# Altium project jarvas_anchor.PrjPcb
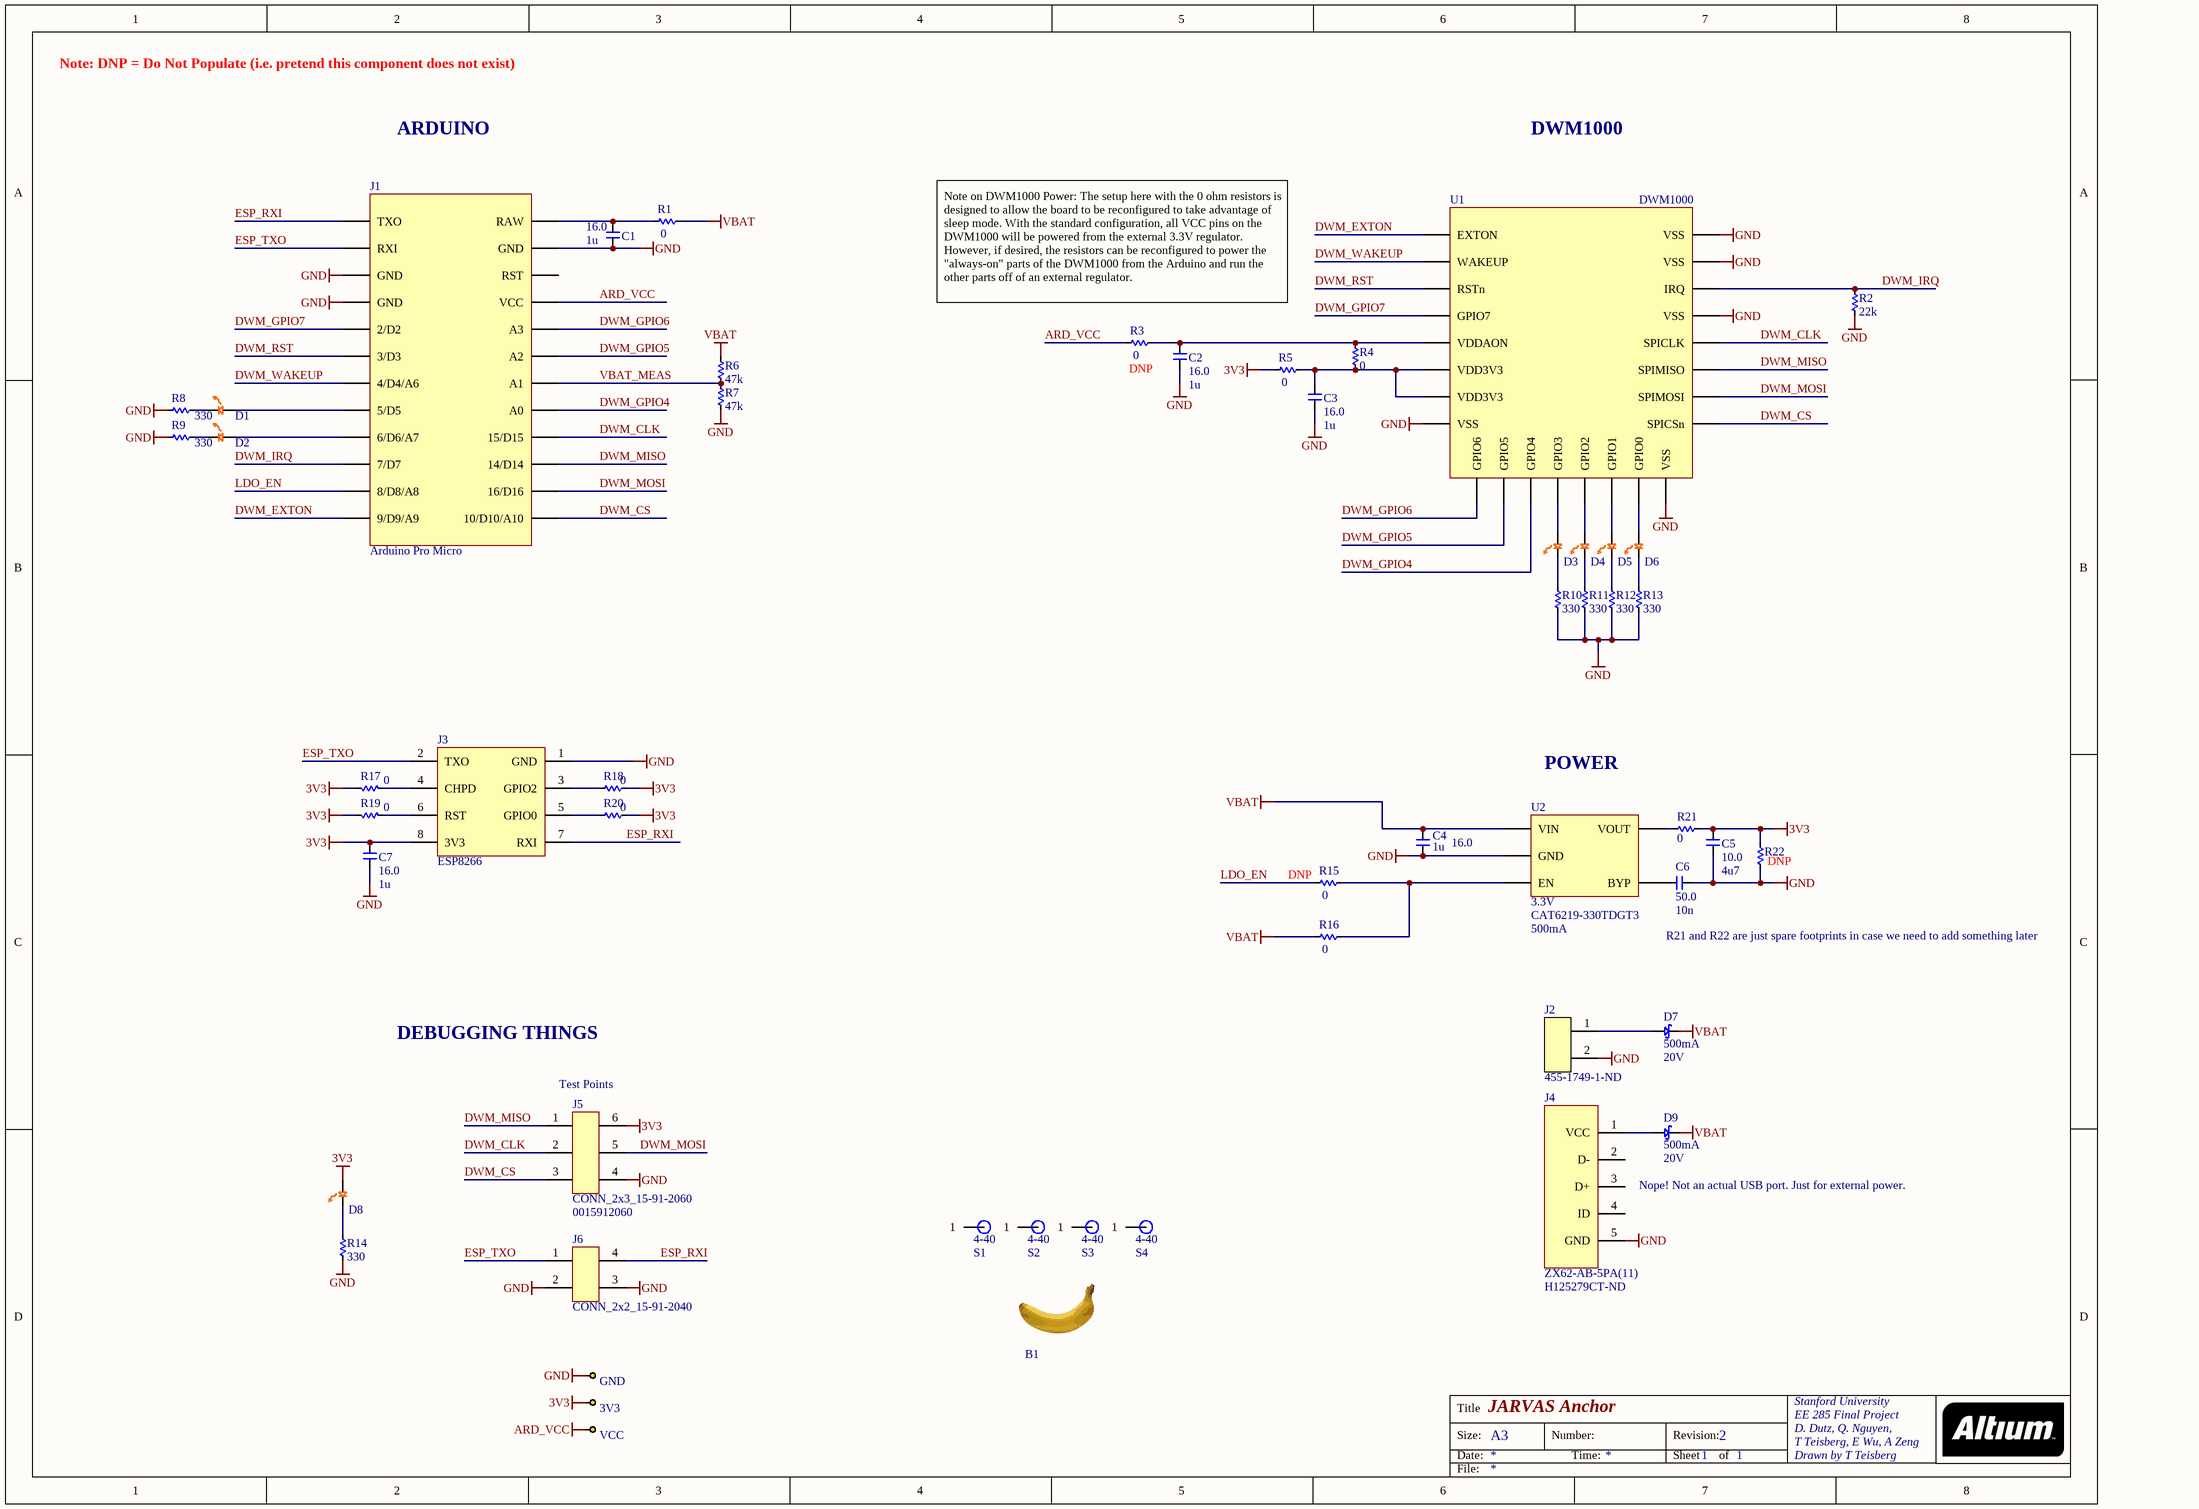
[diagram p0: dwm1000arduino.SchDoc]
1 sheet, 54 parts. Net scope: global (net labels, ports and power ports of the same name join across sheets).
Board file: dwm1000arduino.PcbDoc

## Sheet dwm1000arduino.SchDoc: JARVAS Anchor
size A3; CompanyName: Stanford University; Organization: Stanford University; Address1: EE 285 Final Project; Address2: D. Dutz, Q. Nguyen,; Address3: T Teisberg, E Wu, A Zeng; Address4: Drawn by T Teisberg; Revision: 2; SheetNumber: 1; SheetTotal: 1

### Parts
3V3  TEST_KEYSTONE5015  [TP_KEYSTONE_5015]  (value not drawn)
B1  Banananannaa!  [BANANA_OPEN]  (value not drawn)
C1  voltage: 16.0  human_value: 1u  [C0603]  (hidden comment: __template_cap)
C2  voltage: 16.0  human_value: 1u  [C0603]  (hidden comment: __template_cap)
C3  voltage: 16.0  human_value: 1u  [C0603]  (hidden comment: __template_cap)
C4  voltage: 16.0  human_value: 1u  [C0603]  (hidden comment: __template_cap)
C5  voltage: 10.0  human_value: 4u7  [C0603]  (hidden comment: __template_cap)
C6  voltage: 50.0  human_value: 10n  [C0603]  (hidden comment: __template_cap)
C7  voltage: 16.0  human_value: 1u  [C0603]  (hidden comment: __template_cap)
D1  LED  [LED0603]  (value not drawn)
D2  LED  [LED0603]  (value not drawn)
D3  LED  [LED0603]  (value not drawn)
D4  LED  [LED0603]  (value not drawn)
D5  LED  [LED0603]  (value not drawn)
D6  LED  [LED0603]  (value not drawn)
D7  Current - Average Rectified (Io): 500mA  Voltage - DC Reverse (Vr) (Max): 20V  [SOD123]  (hidden comment: SCHOTTKY_MBR0520L)
D8  LED  [LED0603]  (value not drawn)
D9  Current - Average Rectified (Io): 500mA  Voltage - DC Reverse (Vr) (Max): 20V  [SOD123]  (hidden comment: SCHOTTKY_MBR0520L)
GND  TEST_KEYSTONE5015  [TP_KEYSTONE_5015]  (value not drawn)
J1  Arduino Pro Micro  [ArduinoProMicro]
J2  Supplier Part Number 1: 455-1749-1-ND  [CONN_JST_PH_SM4_2PIN_RA]  (hidden comment: CONN JST 2POS SMD)
J3  ESP8266  [PCBComponent_1]
J4  Manufacturer Part Number: ZX62-AB-5PA(11)  Supplier Part Number 1: H125279CT-ND  [HIROSE_ZX62-AB-5PA]  (hidden comment: CONN_USB_MICROAB_SMD_R/A)
J5  CONN_2x3_15-91-2060  Manufacturer Part Number: 0015912060  [MOLEX_15-91-2060]
J6  CONN_2x2_15-91-2040  [MOLEX_15-91-2040]
R1  Resistance (Machine readable): 0  [R0603]  (hidden comment: __template_resistor)
R2  value 22k  [R0603]  (hidden comment: __template_resistor)
R3  Resistance (Machine readable): 0  [R0603]  (hidden comment: __template_resistor)
R4  Resistance (Machine readable): 0  [R0603]  (hidden comment: __template_resistor)
R5  Resistance (Machine readable): 0  [R0603]  (hidden comment: __template_resistor)
R6  value 47k  [R0603]  (hidden comment: __template_resistor)
R7  value 47k  [R0603]  (hidden comment: __template_resistor)
R8  value 330  [R0603]  (hidden comment: __template_resistor)
R9  value 330  [R0603]  (hidden comment: __template_resistor)
R10  value 330  [R0603]  (hidden comment: __template_resistor)
R11  value 330  [R0603]  (hidden comment: __template_resistor)
R12  value 330  [R0603]  (hidden comment: __template_resistor)
R13  value 330  [R0603]  (hidden comment: __template_resistor)
R14  value 330  [R0603]  (hidden comment: __template_resistor)
R15  Resistance (Machine readable): 0  [R0603]  (hidden comment: __template_resistor)
R16  Resistance (Machine readable): 0  [R0603]  (hidden comment: __template_resistor)
R17  Resistance (Machine readable): 0  [R0603]  (hidden comment: __template_resistor)
R18  Resistance (Machine readable): 0  [R0603]  (hidden comment: __template_resistor)
R19  Resistance (Machine readable): 0  [R0603]  (hidden comment: __template_resistor)
R20  Resistance (Machine readable): 0  [R0603]  (hidden comment: __template_resistor)
R21  value 0  [R0603]  (hidden comment: __template_resistor)
R22  __template_resistor  [R0603]  (value not drawn)
S1  4-40 Machine screw  [SCREW_4-40]  (value not drawn)
S2  4-40 Machine screw  [SCREW_4-40]  (value not drawn)
S3  4-40 Machine screw  [SCREW_4-40]  (value not drawn)
S4  4-40 Machine screw  [SCREW_4-40]  (value not drawn)
U1  DWM1000  [DW1000]
U2  Voltage - Output: 3.3V  Manufacturer Part Number: CAT6219-330TDGT3  Current - Output: 500mA  [TSOT-23-5]  (hidden comment: 3.3V LDO)
VCC  TEST_KEYSTONE5015  [TP_KEYSTONE_5015]  (value not drawn)

### Nets
3V3: 3V3.1 C5.2 C7.1 D8.A J3.8(3V3) J5.6 R5.1 R17.2 R18.2 R19.2 R20.2 R21.2 R22.2
ARD_VCC: J1.21(VCC) R3.1 VCC.1
GND: C1.2 C2.2 C3.2 C4.1 C5.1 C6.2 C7.2 GND.1 J1.3(GND) J1.4(GND) J1.23(GND) J2.2 J3.1(GND) J4.5(GND) J5.4 J6.2 J6.3 R2.1 R7.1 R8.2 R9.2 R10.1 R11.1 R12.1 R13.1 R14.1 R22.1 U1.8(VSS) U1.16(VSS) U1.21(VSS) U1.23(VSS) U1.24(VSS) U2.2(GND)
VBAT: C4.2 D7.2 D9.2 R1.2 R6.2 R16.1 U2.1(VIN)
DWM_CLK: J1.16(15/D15) J5.2 U1.20(SPICLK)
DWM_CS: J1.13(10/D10/A10) J5.3 U1.17(SPICSn)
DWM_EXTON: J1.12(9/D9/A9) U1.1(EXTON)
DWM_GPIO4: J1.17(A0) U1.11(GPIO4)
DWM_GPIO5: J1.19(A2) U1.10(GPIO5)
DWM_GPIO6: J1.20(A3) U1.9(GPIO6)
DWM_GPIO7: J1.5(2/D2) U1.4(GPIO7)
DWM_IRQ: J1.10(7/D7) R2.2 U1.22(IRQ)
DWM_MISO: J1.15(14/D14) J5.1 U1.19(SPIMISO)
DWM_MOSI: J1.14(16/D16) J5.5 U1.18(SPIMOSI)
DWM_RST: J1.6(3/D3) U1.3(RSTn)
DWM_WAKEUP: J1.7(4/D4/A6) U1.2(WAKEUP)
ESP_RXI: J1.1(TXO) J3.7(RXI) J6.4
ESP_TXO: J1.2(RXI) J3.2(TXO) J6.1
LDO_EN: J1.11(8/D8/A8) R15.1
VBAT_MEAS: J1.18(A1) R6.1 R7.2
NetC1_1: C1.1 J1.24(RAW) R1.1
NetC2_1: C2.1 R3.2 R4.2 U1.5(VDDAON)
NetC3_1: C3.1 R4.1 R5.2 U1.6(VDD3V3) U1.7(VDD3V3)
NetC6_1: C6.1 U2.4(BYP)
NetD1_A: D1.A J1.8(5/D5)
NetD1_K: D1.K R8.1
NetD2_A: D2.A J1.9(6/D6/A7)
NetD2_K: D2.K R9.1
NetD3_A: D3.A U1.12(GPIO3)
NetD3_K: D3.K R10.2
NetD4_A: D4.A U1.13(GPIO2)
NetD4_K: D4.K R11.2
NetD5_A: D5.A U1.14(GPIO1)
NetD5_K: D5.K R12.2
NetD6_A: D6.A U1.15(GPIO0)
NetD6_K: D6.K R13.2
NetD7_1: D7.1 J2.1
NetD8_K: D8.K R14.2
NetD9_1: D9.1 J4.1(VCC)
NetJ3_3: J3.3(GPIO2) R18.1
NetJ3_4: J3.4(CHPD) R17.1
NetJ3_5: J3.5(GPIO0) R20.1
NetJ3_6: J3.6(RST) R19.1
NetR15_2: R15.2 R16.2 U2.3(EN)
NetR21_1: R21.1 U2.5(VOUT)

Not connected (* = marked no-connect by the designer): J1 22(RST); J4 2(D-) 3(D+) 4(ID); S1 1; S2 1; S3 1; S4 1

### Notes on the sheet
- Note: DNP = Do Not Populate (i.e. pretend this component does not exist)
- ARDUINO
- DWM1000
- Note on DWM1000 Power: The setup here with the 0 ohm resistors is designed to allow the board to be reconfigured to take advantage of sleep mode. With the standard configuration, all VCC pins on the DWM1000 will be powered from the external 3.3V regulator. However, if desired, the resistors can be reconfigured to power the "always-on" parts of the DWM1000 from the Arduino and run the other parts off of an external regulator.
- POWER
- R21 and R22 are just spare footprints in case we need to add something later
- DEBUGGING THINGS
- (near J5) Test Points
- Nope! Not an actual USB port. Just for external power.
- Title
- Size:
- Date:
- A3
- Number:
- Time:
- Revision:
- Sheet
- of
- File:
- (in symbol SCREW_4-40) 4-40

### Library data of the parts
3V3 GND VCC = TEST_KEYSTONE5015: PC TEST POINT MINIATURE SMT; Manufacturer: Keystone Electronics; Manufacturer Part Number: 5015; Supplier 1: Digi-Key; RoHS: RoHS Compliant; Category: Test and Measurement; Stock 1: 1322985; Pricing 1: 1=0.44, 10=0.413, 50=0.301, 100=0.2891, 250=0.25964, 500=0.24784 (USD); Type: PC Test Point, Miniature; Terminal: 0.010" (0.25mm) Phosphor Bronze, Silver Plate; Mounting Type: Surface Mount; Material: Phosphor Bronze; Color: -; Packaging: Cut Tape (CT); ComponentLink1URL: http://mail.keyelco.com/ENG._DEPT/PDF%20CAT%20NO%20Drawings/5015.pdf; ComponentLink1Description: Datasheet; Supplier Part Number 1: 5015KCT-ND
B1 = BANANA: Banana for scale; Potassium Content: Lots!
C1-C4 C7 = 587-1251-1-ND: type: capacitor; value: 1e-06; tolerance: 10%; Supplier Part Number 1: 587-1251-1-ND; package: 0603; price: 0.125
C5 = 587-1441-1-ND: type: capacitor; value: 4.7e-06; tolerance: 10%; Supplier Part Number 1: 587-1441-1-ND; package: 0603; price: 0.285
C6 = 399-1092-1-ND: type: capacitor; value: 1e-08; tolerance: 5%; Supplier Part Number 1: 399-1092-1-ND; package: 0603; price: 0.075
D1-D6 D8 = LED_LTST-C190KFKT_ORANGE: Orange 605nm LED Indication - Discrete 2V 0603 (1608 Metric); Manufacturer: Lite-On Inc.; Lens Color: Colorless; Lens Transparency: Clear; Millicandela Rating: 90mcd; Lens Style/Size: Rectangle with Flat Top, 1.10mm x 0.80mm; Current - Test: 20mA; Viewing Angle: 130°; Wavelength - Peak: 611nm; Supplier 1: Digi-Key; Manufacturer Part Number: LTST-C190KFKT; RoHS: RoHS Compliant; Category: Optoelectronics; Stock 1: 237550; Pricing 1: 1=0.25, 10=0.183, 25=0.1348, 100=0.0963, 250=0.06544, 500=0.05776, 1000=0.04524 (USD); Packaging: Cut Tape (CT); Part Status: Active; Color: Orange; Voltage - Forward (Vf) (Typ): 2V; Mounting Type: Surface Mount; Wavelength - Dominant: 605nm; Features: -; Package / Case: 0603 (1608 Metric); Supplier Device Package: *; Size / Dimension: 1.60mm L x 0.80mm W; Height (Max): 0.80mm; ComponentLink1URL: http://optoelectronics.liteon.com/upload/download/DS-22-99-0186/S_110_LTST-C190KFKT.pdf; ComponentLink1Description: http://optoelectronics.liteon.com/upload/download/DS-22-99-0186/S_110_LTST-C190KFKT.pdf; Supplier Part Number 1: 160-1434-1-ND
D7 D9 = SCHOTTKY_MBR0520L: DIODE SCHOTTKY 0.5A 20V SOD-123; Manufacturer: Fairchild Semiconductor; Speed: Fast Recovery =< 500ns, > 200mA (Io); Current - Reverse Leakage @ Vr: 250µA @ 20V; Voltage - Forward (Vf) (Max) @ If: 385mV @ 500mA; Supplier 1: Digi-Key; Manufacturer Part Number: MBR0520L; RoHS: RoHS Compliant; Category: Discrete Semiconductor Products; Stock 1: 217232; Pricing 1: 1=0.63, 10=0.43, 100=0.2024, 250=0.1442, 500=0.11006, 750=0.08603, 1000=0.0759 (USD); Diode Type: Schottky; Reverse Recovery Time (trr): -; Capacitance @ Vr, F: -; Mounting Type: Surface Mount; Package / Case: SOD-123; Supplier Device Package: SOD-123; Packaging: Cut Tape (CT); ComponentLink1URL: http://www.fairchildsemi.com/ds/MB/MBR0520L.pdf; ComponentLink1Description: Datasheet; Supplier Part Number 1: MBR0520LCT-ND
J1 = ArduinoProMicro_3V3_8MHz: SFE Arduino Pro Micro 3.3 V / 8 MHz; Supplier: SparkFun Electronics; Supplier Part Number: DEV-12587; ComponentLink1URL: https://cdn.sparkfun.com/datasheets/Dev/Arduino/Boards/ProMicro8MHzv1.pdf; ComponentLink1Description: Graphical Datasheet
J2 = CONN_JST_2_PH: CONN HEADER PH SIDE 2POS 2MM SMD; Manufacturer: JST Sales America Inc.; Manufacturer Part Number: S2B-PH-SM4-TB(LF)(SN); Connector Type: Header, Shrouded; Number of Positions: 2; Number of Positions Loaded: All; Pitch: 0.079" (2.00mm); Supplier 1: Digi-Key; RoHS: RoHS Compliant; Category: Connectors, Interconnects; Stock 1: 148568; Pricing 1: 1=0.56, 10=0.521, 25=0.4688, 50=0.4168, 100=0.3994, 250=0.36472, 500=0.34734 (USD); Packaging: Cut Tape (CT); Contact Type: Male Pin; Number of Rows: 1; Row Spacing: -; Contact Mating Length: 0.130" (3.30mm); Mounting Type: Surface Mount, Right Angle; Termination: Solder; Fastening Type: Detent Lock; Features: Solder Retention; Contact Finish: Tin; Contact Finish Thickness: -; Color: Natural; ComponentLink1URL: http://www.jst-mfg.com/product/pdf/eng/ePH.pdf; ComponentLink1Description: http://www.jst-mfg.com/product/pdf/eng/ePH.pdf
J3 = ESP8266_Module: RF TXRX MODULE WIFI TRACE ANT; Manufacturer: SparkFun Electronics; Manufacturer Part Number: WRL-13678; Protocol: 802.11b/g/n; Frequency: 2.4GHz ~ 2.48GHz; Data Rate: 72.2Mbps; Power - Output: 19.5dBm; Sensitivity: -98dBm; Serial Interfaces: SPI, UART; Antenna Type: Integrated, Trace; Memory Size: 1MB Flash; Voltage - Supply: 3.3V; Current - Receiving: 62mA; Current - Transmitting: 215mA; Supplier 1: Digi-Key; RoHS: RoHS Compliant; Category: RF/IF and RFID; Stock 1: 913; Pricing 1: 1=6.95 (USD); Packaging: Bulk; Part Status: Active; RF Family/Standard: WiFi; Modulation: -; Mounting Type: Through Hole; Operating Temperature: -20°C ~ 100°C; Package / Case: Module; ComponentLink1URL: https://nurdspace.nl/images/e/e0/ESP8266_Specifications_English.pdf; ComponentLink1Description: https://nurdspace.nl/images/e/e0/ESP8266_Specifications_English.pdf; Supplier Part Number 1: 1568-1235-ND; Supplier 2: SparkFun Electronics; Supplier Part Number 2: WRL-13678
J4 = CONN_USB_MICROAB_SMD_R/A: CONN RCPT MICRO USB AB SMD R/A; Manufacturer: Hirose Electric Co Ltd; Connector Type: USB - micro AB; Number of Contacts: 5; Gender: Receptacle; Specifications: USB 2.0; RoHS: RoHS Compliant; Category: Connectors, Interconnects; Packaging: Cut Tape (CT); Mounting Type: Surface Mount, Right Angle, Horizontal; Features: -; Ingress Protection: -; ComponentLink1URL: http://www.hirose.co.jp/cataloge_hp/e24200011.pdf; ComponentLink1Description: Datasheet; Supplier 1: Digi-Key
J5 = CONN_2x3_15-91-2060: CONN HEADER 6POS .100" VERT TIN; Manufacturer: Molex Inc; Connector Type: Header, Unshrouded, Breakaway; Number of Positions: 6; Number of Positions Loaded: All; Pitch: 0.100" (2.54mm); Supplier 1: Digi-Key; RoHS: RoHS Compliant; Category: Connectors, Interconnects; Stock 1: 5665; Pricing 1: 1=0.43, 10=0.4, 50=0.32, 100=0.3066, 250=0.27992, 500=0.2666, 1000=0.21995, 2500=0.19995, 5000=0.19329 (USD); Contact Type: Male Pin; Number of Rows: 2; Row Spacing: 0.100" (2.54mm); Contact Mating Length: 0.240" (6.10mm); Mounting Type: Surface Mount; Termination: Solder; Fastening Type: -; Features: -; Contact Finish: Tin; Contact Finish Thickness: 150µin (3.81µm); Color: Black; Packaging: Bulk; ComponentLink1URL: http://www.molex.com/pdm_docs/sd/015912060_sd.pdf; ComponentLink1Description: http://www.molex.com/pdm_docs/sd/015912060_sd.pdf; Supplier Part Number 1: WM17449-ND
J6 = CONN_2x2_15-91-2040: CONN HEADER 4POS .100" VERT TIN
R1 R3-R5 R15-R20 = CRCW06030000Z0EA: RES SMD 0.0 OHM; Manufacturer: Vishay Dale; Value: 1; Unit Price (USD): 0.081; Tolerance: ±1%; Power (Watts): 0.1W, 1/10W; Supplier Part Number: 541-0.0GCT-ND; Manufacturer Part Number: CRCW06030000Z0EA; type: resistor; Packaging: Cut Tape (CT); Series: CRCW; Package: 0603 (1608 Metric)
  R3 R15: DNP: DNP
R2 = CRCW060322K0FKEA: RES SMD 22K OHM 1% 1/10W 0603; Manufacturer: Vishay Dale; Resistance (Machine readable): 22000; Unit Price (USD): 0.081; Power (Watts): 0.1W, 1/10W; Supplier Part Number: 541-22.0KHCT-ND; Manufacturer Part Number: CRCW060322K0FKEA; type: resistor; Packaging: Cut Tape (CT); Series: CRCW; Tolerance: ±1%; Package: 0603 (1608 Metric)
R6 R7 = CRCW060347K0FKEA: RES SMD 47K OHM 1% 1/10W 0603; Manufacturer: Vishay Dale; Resistance (Machine readable): 47000; Unit Price (USD): 0.081; Power (Watts): 0.1W, 1/10W; Supplier Part Number: 541-47.0KHCT-ND; Manufacturer Part Number: CRCW060347K0FKEA; type: resistor; Packaging: Cut Tape (CT); Series: CRCW; Tolerance: ±1%; Package: 0603 (1608 Metric)
R8-R14 = CRCW0603330RFKEA: RES SMD 330 OHM 1% 1/10W 0603; Manufacturer: Vishay Dale; Unit Price (USD): 0.081; Power (Watts): 0.1W, 1/10W; Supplier Part Number: 541-330HCT-ND; Manufacturer Part Number: CRCW0603330RFKEA; Resistance (Machine readable): 330; type: resistor; Packaging: Cut Tape (CT); Series: CRCW; Tolerance: ±1%; Package: 0603 (1608 Metric)
R21 = CRCW06030000Z0EA: RES SMD 0.0 OHM; Manufacturer: Vishay Dale; Unit Price (USD): 0.081; Tolerance: ±1%; Power (Watts): 0.1W, 1/10W; Supplier Part Number: 541-0.0GCT-ND; Manufacturer Part Number: CRCW06030000Z0EA; Resistance (Machine readable): 0; type: resistor; Packaging: Cut Tape (CT); Series: CRCW; Package: 0603 (1608 Metric)
R22 = CRCW06030000Z0EA: RES SMD 0.0 OHM; Manufacturer: Vishay Dale; Value: 0; Unit Price (USD): 0.081; Tolerance: ±1%; Power (Watts): 0.1W, 1/10W; Supplier Part Number: 541-0.0GCT-ND; Manufacturer Part Number: CRCW06030000Z0EA; Resistance (Machine readable): 0; type: resistor; Packaging: Cut Tape (CT); Series: CRCW; Package: 0603 (1608 Metric); DNP: DNP
S1-S4 = SCREW_4-40: Supplier 1: Digi-Key
U1 = DWM1000: Manufacturer: Decawave Limited; Protocol: IR-UWB; Modulation: BPM, BPSK; Frequency: 3.5GHz ~ 6.5GHz; Data Rate: 6.8Mbps; Serial Interfaces: SPI; Antenna Type: Integrated, Chip; Voltage - Supply: 2.8 V ~ 3.6 V; Current - Receiving: 64mA; Current - Transmitting: 31mA; Supplier 1: Digi-Key; Manufacturer Part Number: DWM1000; RoHS: RoHS Compliant; Category: RF/IF and RFID; Stock 1: 8794; Pricing 1: 1=25.59, 10=23.625, 25=21.6564, 100=20.0156, 250=19.03124 (USD); Packaging: Cut Tape (CT); Part Status: Active; RF Family/Standard: 802.15.4; Power - Output: -; Sensitivity: -; Memory Size: -; Mounting Type: Surface Mount; Operating Temperature: -40°C ~ 85°C; Package / Case: Module; ComponentLink1URL: http://www.decawave.com/sites/default/files/resources/dwm1000-datasheet-v1.4.pdf; ComponentLink1Description: http://www.decawave.com/sites/default/files/resources/dwm1000-datasheet-v1.4.pdf; Supplier Part Number 1: 1479-1002-1-ND
U2 = LDO_CAT6219_3V3: Linear Voltage Regulator IC Positive Fixed 1 Output 3.3V 500mA TSOT-23-5; Manufacturer: ON Semiconductor; Voltage - Dropout (Typical): 0.3V @ 500mA; Number of Regulators: 1; Voltage - Input: Up to 5.5V; Supplier 1: Digi-Key; RoHS: RoHS Compliant; Category: Integrated Circuits (ICs); Stock 1: 7748; Pricing 1: 1=0.92, 10=0.821, 100=0.6399, 500=0.5292, 1000=0.4185 (USD); Packaging: Cut Tape (CT); Part Status: Active; Regulator Topology: Positive Fixed; Current - Limit (Min): -; Operating Temperature: -40°C ~ 125°C; Mounting Type: Surface Mount; Package / Case: SOT-23-5 Thin, TSOT-23-5; Supplier Device Package: TSOT-23-5; ComponentLink1URL: http://www.onsemi.com/pub_link/Collateral/CAT6219-D.PDF; ComponentLink1Description: http://www.onsemi.com/pub_link/Collateral/CAT6219-D.PDF; Supplier Part Number 1: CAT6219-330TDGT3CT-ND